# EAGLE design max32620fthr (EAGLE 7.5.0)
COMPANY: MAXIM INTEGRATED; DRAWN: GSTEIERT; REV: 2; TITLE: MAX32620FTHR

## Sheet 1 of 2
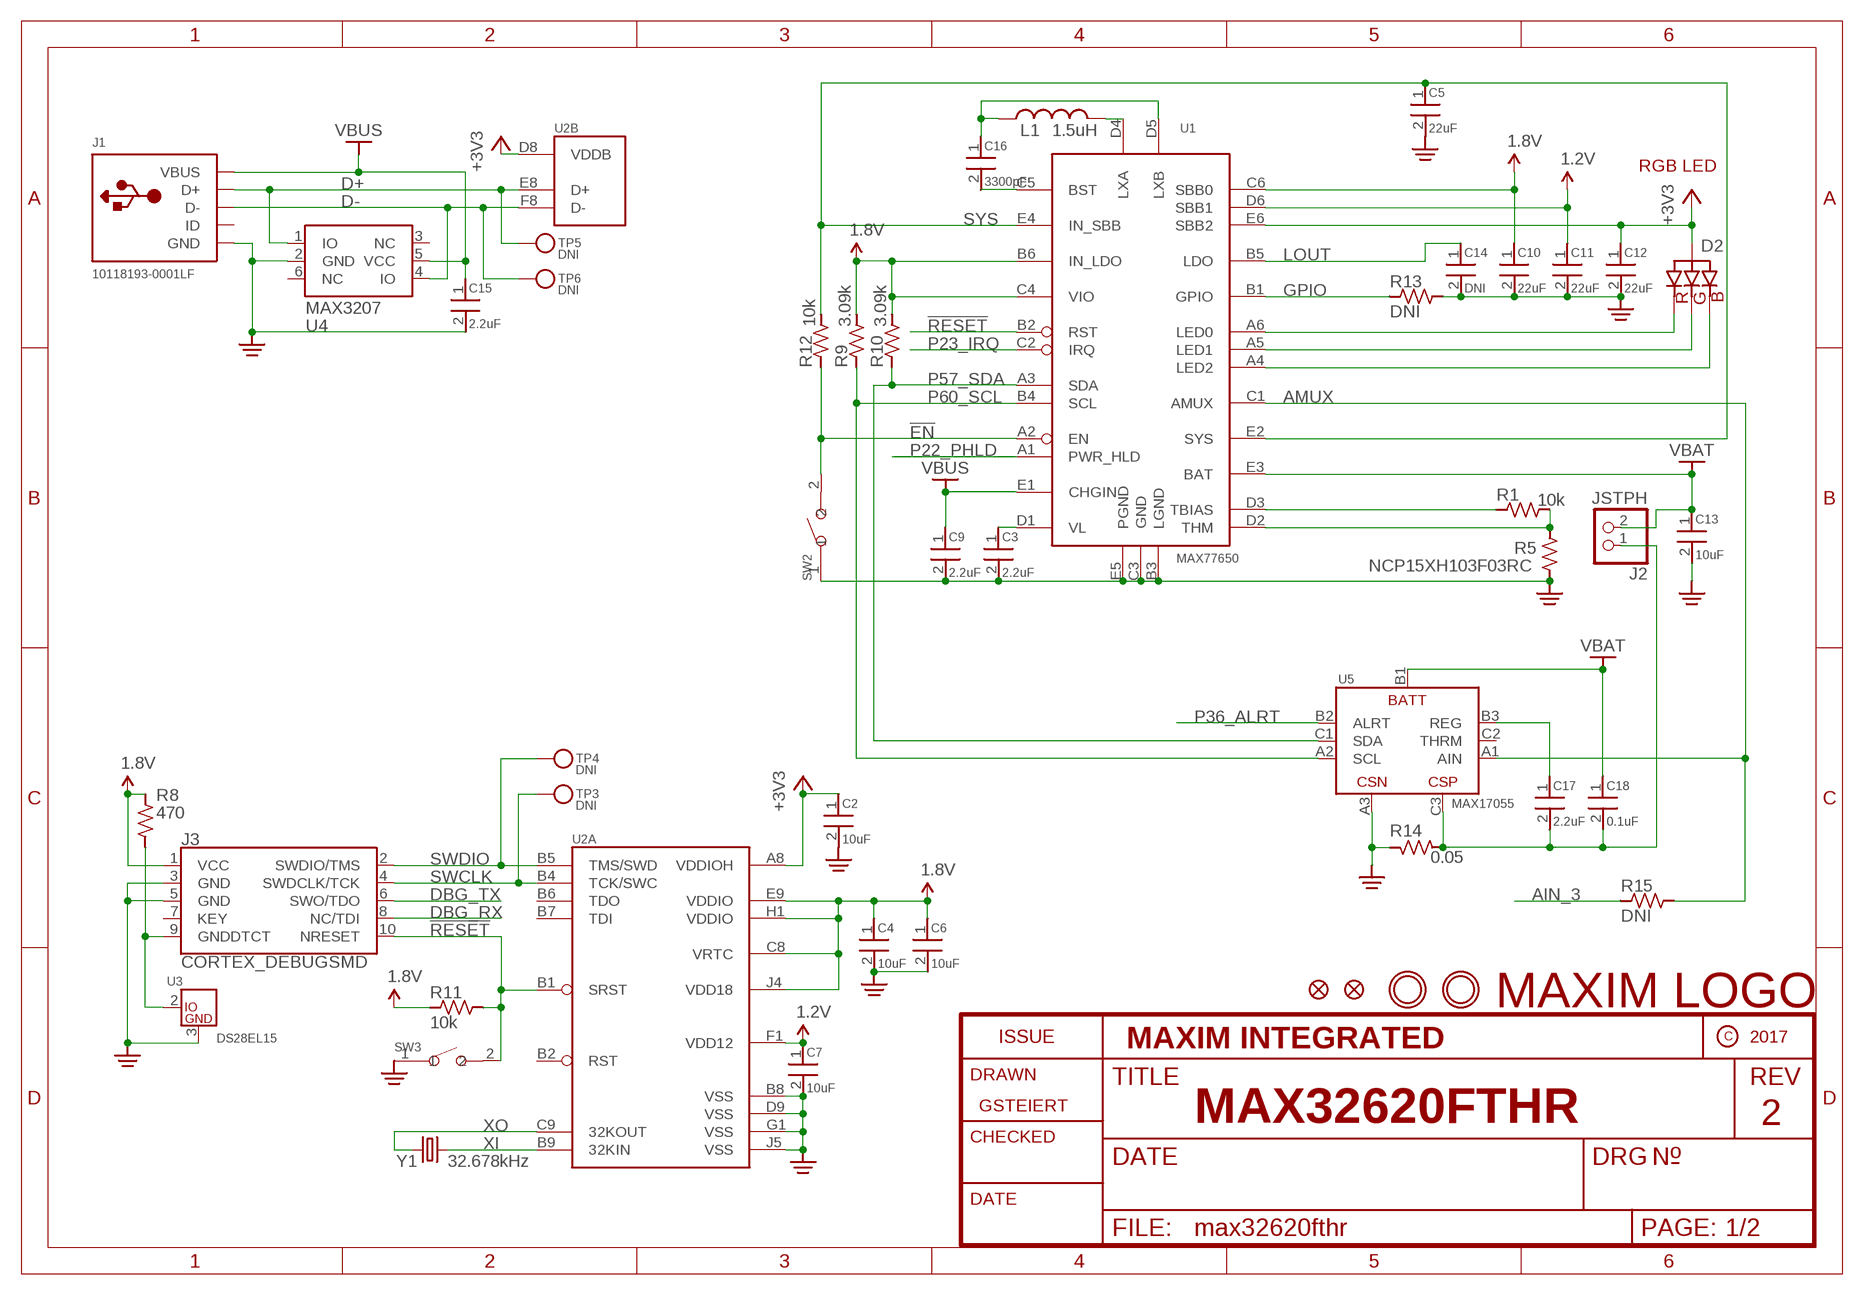
[diagram p0: schematic, sheet 1]

### Parts
C2  10uF  C0402  [0402]
C3  2.2uF  C0402  [0402]
C4  10uF  C0402  [0402]
C5  22uF  C0402  [0402]
C6  10uF  C0402  [0402]
C7  10uF  C0402  [0402]
C9  2.2uF  C0402  [0402]
C10  22uF  C0402  [0402]
C11  22uF  C0402  [0402]
C12  22uF  C0402  [0402]
C13  10uF  C0402  [0402]
C14  DNI  C0402  [0402]
C15  2.2uF  C0402  [0402]
C16  3300pF  C0402  [0402]
C17  2.2uF  C0402  [0402]
C18  0.1uF  C0402  [0402]
D2  RGBLED_CALUMIX-SML-LX0404  [LUMIX-SML-LX0404]
J1  10118193-0001LF  MICRO-USB-SMD-B-(10118193-0001LF)  [MICRO-USB5+6P-SMD-0.65-B]
J2  JSTPH  CON_JST_PH_2PIN  [JSTPH2]
J3  CORTEX_DEBUGSMD  [SAMTECH_FTSH-105-01]
L1  1.5uH  INDUCTOR2016  [IND2016]
R1  10k  R  [0402]
R5  NCP15XH103F03RC  R  [0402]
R8  470  R  [0402]
R9  3.09k  R  [0402]
R10  3.09k  R  [0402]
R11  10k  R  [0402]
R12  10k  R  [0402]
R13  DNI  R  [0402]
R14  0.05  R  [0402]
R15  DNI  R  [0402]
SW2  SMD-BUTTON(2P-3.0X2.5X1.2+0.4MM)-B3U-1000P-2P-SMD  [SW2-2.6-3.0X2.5X1.2+0.4MM]
SW3  SMD-BUTTON(2P-3.0X2.5X1.2+0.4MM)-B3U-1000P-2P-SMD  [SW2-2.6-3.0X2.5X1.2+0.4MM]
TP3  DNI  TESTPOINTROUND1MM  [TESTPOINT_ROUND_1MM]
TP4  DNI  TESTPOINTROUND1MM  [TESTPOINT_ROUND_1MM]
TP5  DNI  TESTPOINTROUND1MM  [TESTPOINT_ROUND_1MM]
TP6  DNI  TESTPOINTROUND1MM  [TESTPOINT_ROUND_1MM]
U1  MAX77650  [W302H2-1]
U2  MAX32620  [W813D3-1]
U3  DS28EL15  [T633-2]
U4  MAX3207  [SOT23-6]
U5  MAX17055  [W91N1-1]
U$3  DNI  MAXIM_LOGO  [MXM_LOGO_6MM]
U$31  DNI  MOUNTINGHOLE2.5  [MOUNTINGHOLE_2.5_PLATED]
U$32  DNI  MOUNTINGHOLE2.5  [MOUNTINGHOLE_2.5_PLATED]
U$34  DNI  FIDUCIAL""  [FIDUCIAL_1MM]
U$35  DNI  FIDUCIAL""  [FIDUCIAL_1MM]
Y1  32.678kHz  FC-12M  [FC-12M]

### Nets
1.2V: C7.1 C11.1 U1.D6(SBB1) U2.F1(A:VDD12)
1.8V: C4.1 C6.1 C10.1 J3.1(VCC) R8.2 R9.2 R10.2 R11.1 U1.B6(IN_LDO) U1.C4(VIO) U1.C6(SBB0) U2.C8(A:VRTC) U2.E9(A:VDDIO) U2.H1(A:VDDIO) U2.J4(A:VDD18) ; also sheet 2
!EN: R12.1 SW2.2 U1.A2(EN) ; also sheet 2
!RESET: J3.10(NRESET) R11.2 SW3.2 U1.B2(RST) U2.B1(A:SRST) ; also sheet 2
+3V3: C2.1 C12.1 D2.1(VCC) U1.E6(SBB2) U2.A8(A:VDDIOH) U2.D8(B:VDDB) ; also sheet 2
AIN_3: R15.1 ; also sheet 2
AMUX: R15.2 U1.C1(AMUX) U5.A1(AIN)
D+: J1.3(D+) TP5.P$1 U2.E8(B:D+) U4.1(IO)
D-: J1.2(D-) TP6.P$1 U2.F8(B:D-) U4.4(IO)
DBG_RX: J3.8(NC/TDI) ; also sheet 2
DBG_TX: J3.6(SWO/TDO) ; also sheet 2
GND: C2.2 C3.2 C4.2 C5.2 C6.2 C7.2 C9.2 C10.2 C11.2 C12.2 C13.2 C14.2 C15.2 J1.5(GND) J1.S1(GND) J1.S2(GND) J1.S3(GND) J1.S4(GND) J1.S5(GND) J1.S6(GND) J3.3(GND) J3.5(GND) R5.2 R13.2 R14.2 SW2.1 SW3.1 U1.B3(LGND) U1.C3(GND) U1.E5(PGND) U2.B8(A:VSS) U2.D9(A:VSS) U2.G1(A:VSS) U2.J5(A:VSS) U3.3(GND) U4.2(GND) U5.A3(CSN) ; also sheet 2
GPIO: R13.1 U1.B1(GPIO)
LOUT: C14.1 U1.B5(LDO)
N$1: D2.2(RED) U1.A6(LED0)
N$2: D2.4(GREEN) U1.A5(LED1)
N$3: D2.3(BLUE) U1.A4(LED2)
N$6: C3.1 U1.D1(VL)
N$8: R1.2 R5.1 U1.D2(THM)
N$9: R1.1 U1.D3(TBIAS)
N$13: J3.9(GNDDTCT) R8.1 U3.2(IO)
N$14: C17.2 C18.2 J2.1 R14.1 U5.C3(CSP)
N$15: C17.1 U5.B3(REG)
N$17: C16.2 U1.C5(BST)
N$18: C16.1 L1.1 U1.D5(LXB)
N$19: L1.2 U1.D4(LXA)
P22_PHLD: U1.A1(PWR_HLD) ; also sheet 2
P23_IRQ: U1.C2(IRQ) ; also sheet 2
P36_ALRT: U5.B2(ALRT) ; also sheet 2
P57_SDA: R10.1 U1.A3(SDA) U5.C1(SDA) ; also sheet 2
P60_SCL: R9.1 U1.B4(SCL) U5.A2(SCL) ; also sheet 2
SWCLK: J3.4(SWDCLK/TCK) TP3.P$1 U2.B4(A:TCK/SWC)
SWDIO: J3.2(SWDIO/TMS) TP4.P$1 U2.B5(A:TMS/SWD)
SYS: C5.1 R12.2 U1.E2(SYS) U1.E4(IN_SBB) ; also sheet 2
VBAT: C13.1 C18.1 J2.2 U1.E3(BAT) U5.B1(BATT) ; also sheet 2
VBUS: C9.1 C15.1 J1.1(VBUS) U1.E1(CHGIN) U4.5(VCC) ; also sheet 2
XI: U2.B9(A:32KIN) Y1.2
XO: U2.C9(A:32KOUT) Y1.1
Unconnected: J1.4(ID) J3.7(KEY) U2.B2(A:RST) U2.B6(A:TDO) U2.B7(A:TDI) U4.3(NC) U4.6(NC) U5.C2(THRM)

### Notes on the sheet
- RGB LED

## Sheet 2 of 2
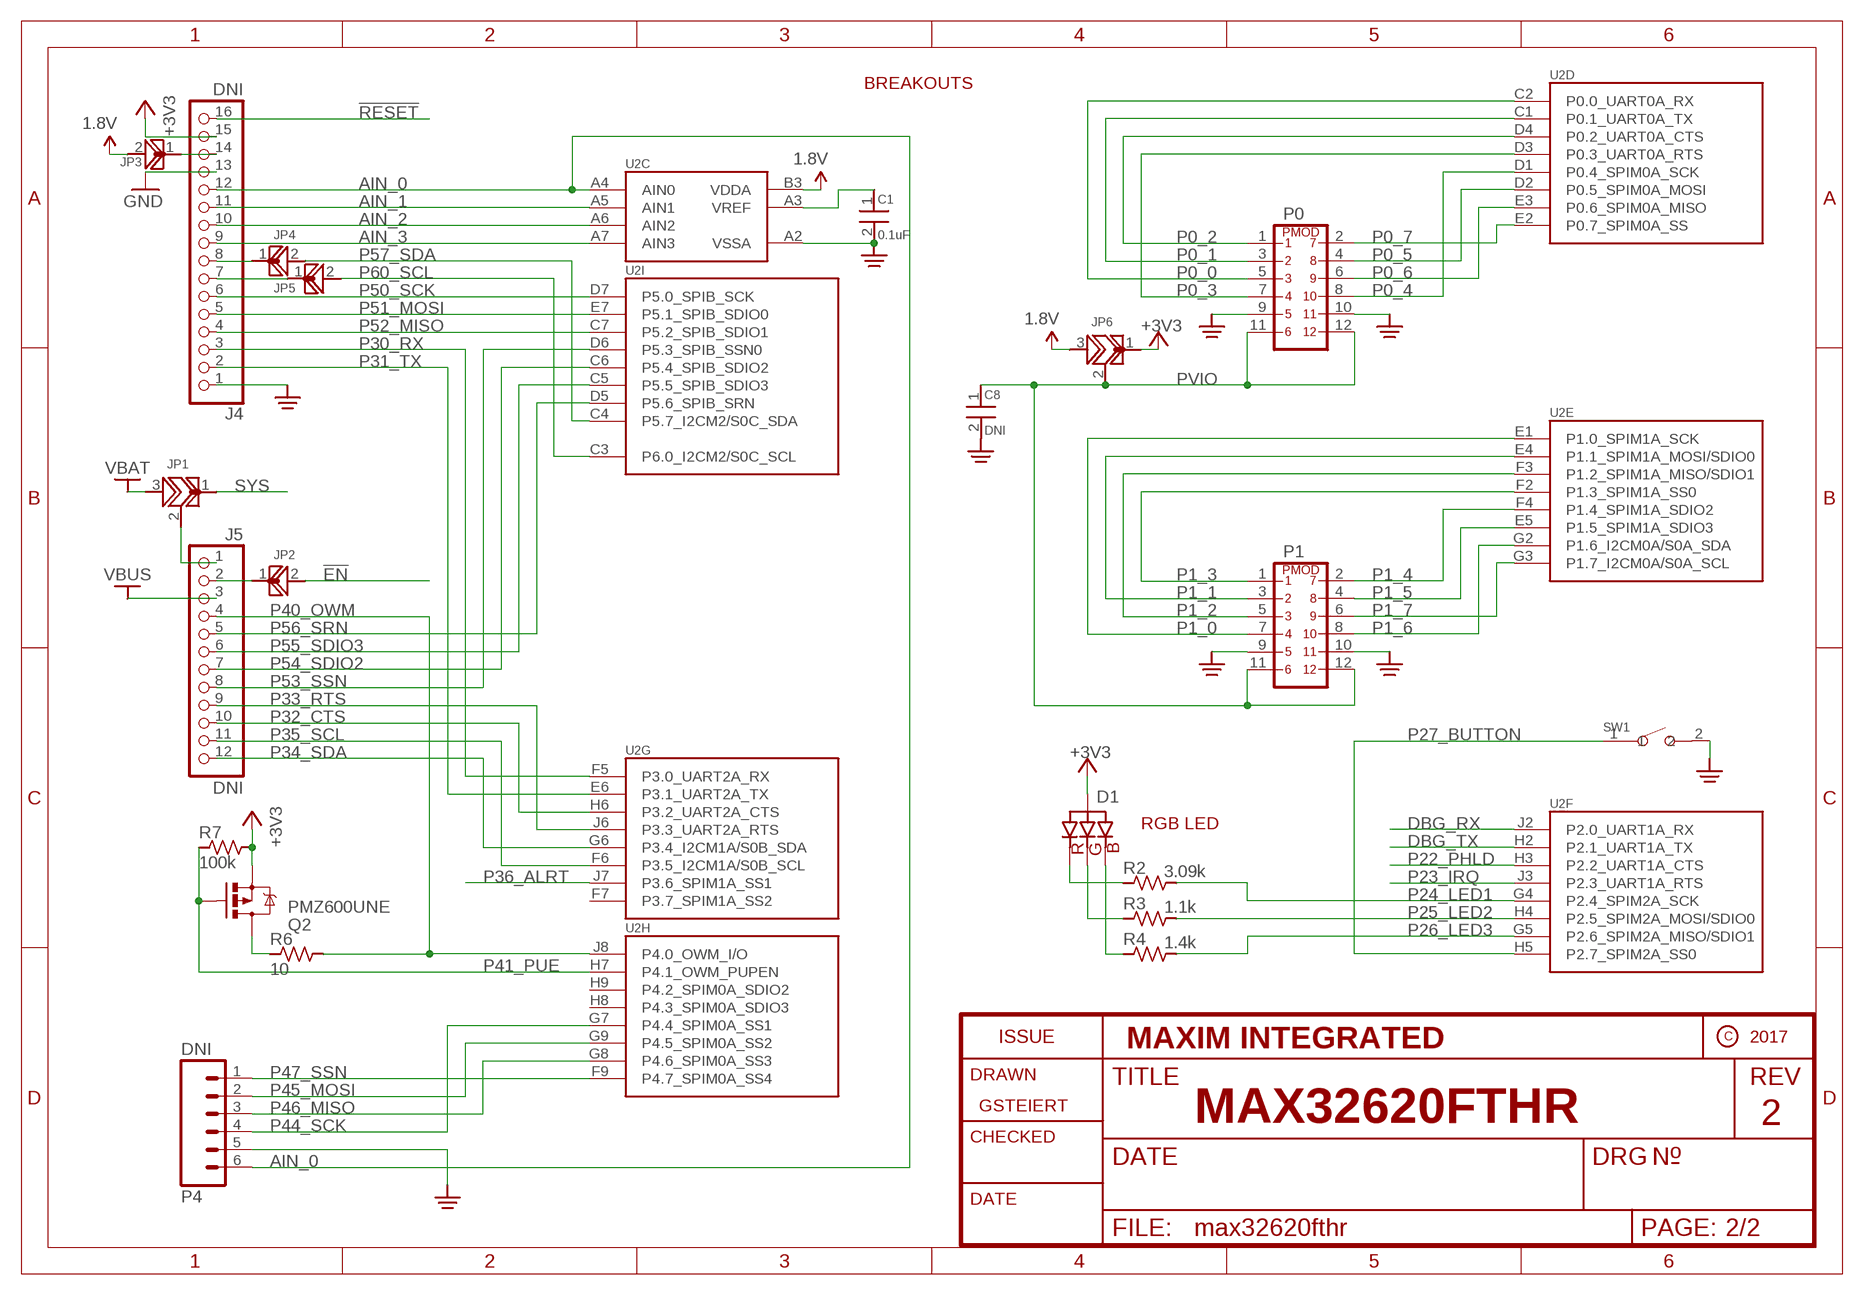
[diagram p1: schematic, sheet 2]

### Parts
C1  0.1uF  C0402  [0402]
C8  DNI  C0402  [0402]
D1  RGBLED_CALUMIX-SML-LX0404  [LUMIX-SML-LX0404]
J4  DNI  HEADER-1X16ROUND  [1X16_ROUND]
J5  DNI  HEADER-1X12  [1X12_ROUND]
JP1  DNI  SOLDER_SELECTOR  [SS0402]
JP2  DNI  SOLDER_BRIDGE  [SB0402]
JP3  DNI  SOLDER_BRIDGE  [SB0402]
JP4  DNI  SOLDER_BRIDGE  [SB0402]
JP5  DNI  SOLDER_BRIDGE  [SB0402]
JP6  DNI  SOLDER_SELECTOR  [SS0402]
P0  PMOD_DUALPASSTHROUGH  [2X6_HLE_BE]
P1  PMOD_DUALPASSTHROUGH  [2X6_HLE_BE]
P4  DNI  M061X06-SMD_EDGE_FEMALE  [1X06-SMD_EDGE]
Q2  PMZ600UNE  [SOT-883]
R2  3.09k  R  [0402]
R3  1.1k  R  [0402]
R4  1.4k  R  [0402]
R6  10  R  [0402]
R7  100k  R  [0402]
SW1  SMD-BUTTON(2P-3.0X2.5X1.2+0.4MM)-B3U-1000P-2P-SMD  [SW2-2.6-3.0X2.5X1.2+0.4MM]

### Nets
1.8V: JP3.2 JP6.3 U2.B3(C:VDDA) ; also sheet 1
!EN: JP2.2 ; also sheet 1
!RESET: J4.16 ; also sheet 1
+3V3: D1.1(VCC) J4.15 JP6.1 Q2.2(S) R7.2 ; also sheet 1
AIN_0: J4.12 P4.6 U2.A4(C:AIN0)
AIN_1: J4.11 U2.A5(C:AIN1)
AIN_2: J4.10 U2.A6(C:AIN2)
AIN_3: J4.9 U2.A7(C:AIN3) ; also sheet 1
DBG_RX: U2.J2(F:P2.0_UART1A_RX) ; also sheet 1
DBG_TX: U2.H2(F:P2.1_UART1A_TX) ; also sheet 1
GND: C1.2 C8.2 J4.1 J4.13 P0.9 P0.10 P1.9 P1.10 P4.5 SW1.2 U2.A2(C:VSSA) ; also sheet 1
N$4: J4.8 JP4.1
N$5: J4.7 JP5.1
N$7: J4.14 JP3.1
N$10: J5.2 JP2.1
N$11: J5.1 JP1.2
N$46: D1.2(RED) R2.1
N$47: D1.4(GREEN) R3.1
N$48: D1.3(BLUE) R4.1
N$50: Q2.3(D) R6.1
N$55: C1.1 U2.A3(C:VREF)
P0_0: P0.5 U2.C2(D:P0.0_UART0A_RX)
P0_1: P0.3 U2.C1(D:P0.1_UART0A_TX)
P0_2: P0.1 U2.D4(D:P0.2_UART0A_CTS)
P0_3: P0.7 U2.D3(D:P0.3_UART0A_RTS)
P0_4: P0.8 U2.D1(D:P0.4_SPIM0A_SCK)
P0_5: P0.4 U2.D2(D:P0.5_SPIM0A_MOSI)
P0_6: P0.6 U2.E3(D:P0.6_SPIM0A_MISO)
P0_7: P0.2 U2.E2(D:P0.7_SPIM0A_SS)
P1_0: P1.7 U2.E1(E:P1.0_SPIM1A_SCK)
P1_1: P1.3 U2.E4(E:P1.1_SPIM1A_MOSI/SDIO0)
P1_2: P1.5 U2.F3(E:P1.2_SPIM1A_MISO/SDIO1)
P1_3: P1.1 U2.F2(E:P1.3_SPIM1A_SS0)
P1_4: P1.2 U2.F4(E:P1.4_SPIM1A_SDIO2)
P1_5: P1.4 U2.E5(E:P1.5_SPIM1A_SDIO3)
P1_6: P1.8 U2.G2(E:P1.6_I2CM0A/S0A_SDA)
P1_7: P1.6 U2.G3(E:P1.7_I2CM0A/S0A_SCL)
P22_PHLD: U2.H3(F:P2.2_UART1A_CTS) ; also sheet 1
P23_IRQ: U2.J3(F:P2.3_UART1A_RTS) ; also sheet 1
P24_LED1: R2.2 U2.G4(F:P2.4_SPIM2A_SCK)
P25_LED2: R3.2 U2.H4(F:P2.5_SPIM2A_MOSI/SDIO0)
P26_LED3: R4.2 U2.G5(F:P2.6_SPIM2A_MISO/SDIO1)
P27_BUTTON: SW1.1 U2.H5(F:P2.7_SPIM2A_SS0)
P30_RX: J4.3 U2.F5(G:P3.0_UART2A_RX)
P31_TX: J4.2 U2.E6(G:P3.1_UART2A_TX)
P32_CTS: J5.10 U2.H6(G:P3.2_UART2A_CTS)
P33_RTS: J5.9 U2.J6(G:P3.3_UART2A_RTS)
P34_SDA: J5.12 U2.G6(G:P3.4_I2CM1A/S0B_SDA)
P35_SCL: J5.11 U2.F6(G:P3.5_I2CM1A/S0B_SCL)
P36_ALRT: U2.J7(G:P3.6_SPIM1A_SS1) ; also sheet 1
P40_OWM: J5.4 R6.2 U2.J8(H:P4.0_OWM_I/O)
P41_PUE: Q2.1(G) R7.1 U2.H7(H:P4.1_OWM_PUPEN)
P44_SCK: P4.4 U2.G7(H:P4.4_SPIM0A_SS1)
P45_MOSI: P4.2 U2.G9(H:P4.5_SPIM0A_SS2)
P46_MISO: P4.3 U2.G8(H:P4.6_SPIM0A_SS3)
P47_SSN: P4.1 U2.F9(H:P4.7_SPIM0A_SS4)
P50_SCK: J4.6 U2.D7(I:P5.0_SPIB_SCK)
P51_MOSI: J4.5 U2.E7(I:P5.1_SPIB_SDIO0)
P52_MISO: J4.4 U2.C7(I:P5.2_SPIB_SDIO1)
P53_SSN: J5.8 U2.D6(I:P5.3_SPIB_SSN0)
P54_SDIO2: J5.7 U2.C6(I:P5.4_SPIB_SDIO2)
P55_SDIO3: J5.6 U2.C5(I:P5.5_SPIB_SDIO3)
P56_SRN: J5.5 U2.D5(I:P5.6_SPIB_SRN)
P57_SDA: JP4.2 U2.C4(I:P5.7_I2CM2/S0C_SDA) ; also sheet 1
P60_SCL: JP5.2 U2.C3(I:P6.0_I2CM2/S0C_SCL) ; also sheet 1
PVIO: C8.1 JP6.2 P0.11 P0.12 P1.11 P1.12
SYS: JP1.1 ; also sheet 1
VBAT: JP1.3 ; also sheet 1
VBUS: J5.3 ; also sheet 1
Unconnected: U2.F7(G:P3.7_SPIM1A_SS2) U2.H8(H:P4.3_SPIM0A_SDIO3) U2.H9(H:P4.2_SPIM0A_SDIO2)

### Notes on the sheet
- BREAKOUTS
- RGB LED

## Library data of the parts
C1-C18 = maxlib:C: C Capacitor
D1 D2 = maxlib:RGBLED_CA: RGB LED, common-anode Lumix SML-LX0404 1mm x 1mm 5MM Staggered pins 5mm Piranha package http://www.ladyada.net/library/pcb/eaglelibrary.html
J1 = maxlib:MICRO-USB-SMD-B-(10118193-0001LF): 320010003; MPN: 10118193-0001LF
J2 = microbuilder:CON_JST_PH_2PIN: JST 2-Pin Right-Angle Connector PH-Series - 4UConnector: 17311 SH-Series - 4UConnector: 07278
J3 = maxlib:CORTEX_DEBUG: Cortex Debug Connector Datasheet <http://infocenter.arm.com/help/topic/com.arm.doc.faqs/attached/13634/cortex_debug_connectors.pdf>
J4 = microbuilder:HEADER-1X16: PIN HEADER
J5 = microbuilder:HEADER-1X12
JP1 JP6 = maxlib:SOLDER_SELECTOR: Solder Selector 0402
JP2-JP5 = maxlib:SOLDER_BRIDGE: Solder Bridge 0402
L1 = maxlib:INDUCTOR: Inductor Inductors
P0 P1 = maxlib:PMOD_DUAL: Dual Row PMOD Header
P4 = SparkFun-Connectors:M06: Header 6 Standard 6-pin 0.1" header. Use with straight break away headers (SKU : PRT-00116), right angle break away headers (PRT-00553), swiss pins (PRT-00743), machine pins (PRT-00117), and female headers (PRT-00115). Molex polarized connector foot print use with SKU : PRT-08094 with associated crimp pins and housings. NOTES ON THE VARIANTS LOCK and LOCK_LONGPADS... This footprint was designed to help hold the alignment of a through-hole component (i.e. 6-pin header) while soldering it into place. You may notice that each hole has been shifted either up or down by 0.005 of an inch from it's more standard position (which is a perfectly straight line). This slight alteration caused the pins (the squares in the middle) to touch the edges of the holes. Because they are alternating, it causes a "brace" to hold the component in place. 0.005 has proven to be the perfect amount of "off-center" position when using our standard breakaway headers. Although looks a little odd when you look at the bare footprint, once you have a header in there, the alteration is very hard to notice. Also,if you push a header all the way into place, it is covered up entirely on the bottom side. This idea of altering the position of holes to aid alignment will be further integrated into the Sparkfun Library for other footprints. It can help hold any component with 3 or more connection pins.
Q2 = maxlib:PMZ600UNE
R1-R15 = maxlib:R: Resistor
SW1-SW3 = maxlib:SMD-BUTTON(2P-3.0X2.5X1.2+0.4MM): 311020047
TP3-TP6 = maxlib:TESTPOINT: Test Point Various test points for characterisation and PCB testing TESTPOINT_SMT - Compact Surface Mount Test Point [Digikey: 5016KTR-ND]
U1 = maxlib:MAX77650: MAX77650 Ultra-Low Power SIMO PMIC Battery Charger with Smart Power Selector 3 output Single Inductor Multiple Output Buck-Boost 150mA LDO 3 channel LED current sink Voltage Monitor Multiplexer
U2 = maxlib:MAX32620: MAX32620 Ultra-Low Power, High-Performance Cortex-M4F Microcontroller for Wearables
U3 = maxlib:DS28EL15: DS28EL15 1-Wire SHA-256 and 512-Bit EEPROM
U4 = maxlib:MAX3207: MAX3207 DUAL ESD with TVS
U5 = maxlib:MAX17055: MAX17055 ModelGauge m5 EZ, 1-Cell Fuel Gauge
U$3 = maxlib:MAXIM_LOGO: Maxim Logo
U$31 U$32 = microbuilder:MOUNTINGHOLE: Mounting Hole For #2 screws (0.086"/2.18mm width, 0.094"/2.4mm hole) use 2.5mm; BOM: EXCLUDE
U$34 U$35 = microbuilder:FIDUCIAL: Fiducial Alignment Points Various fiducial points for machine vision alignment.; BOM: EXCLUDE
Y1 = maxlib:FC-12M: kHz RANGE CRYSTAL UNIT LOW PROFILE SMD Source: Epson Toyocom FC-12M.pdf

## Board
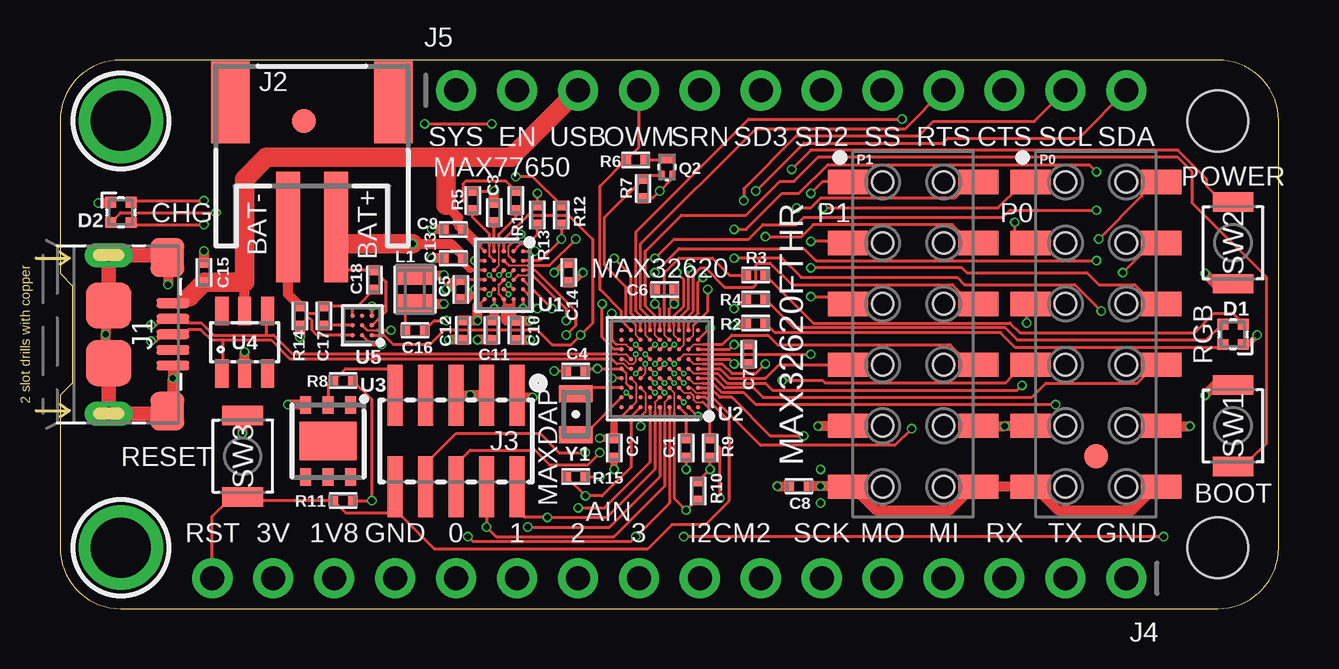
[diagram p2: board, top side]
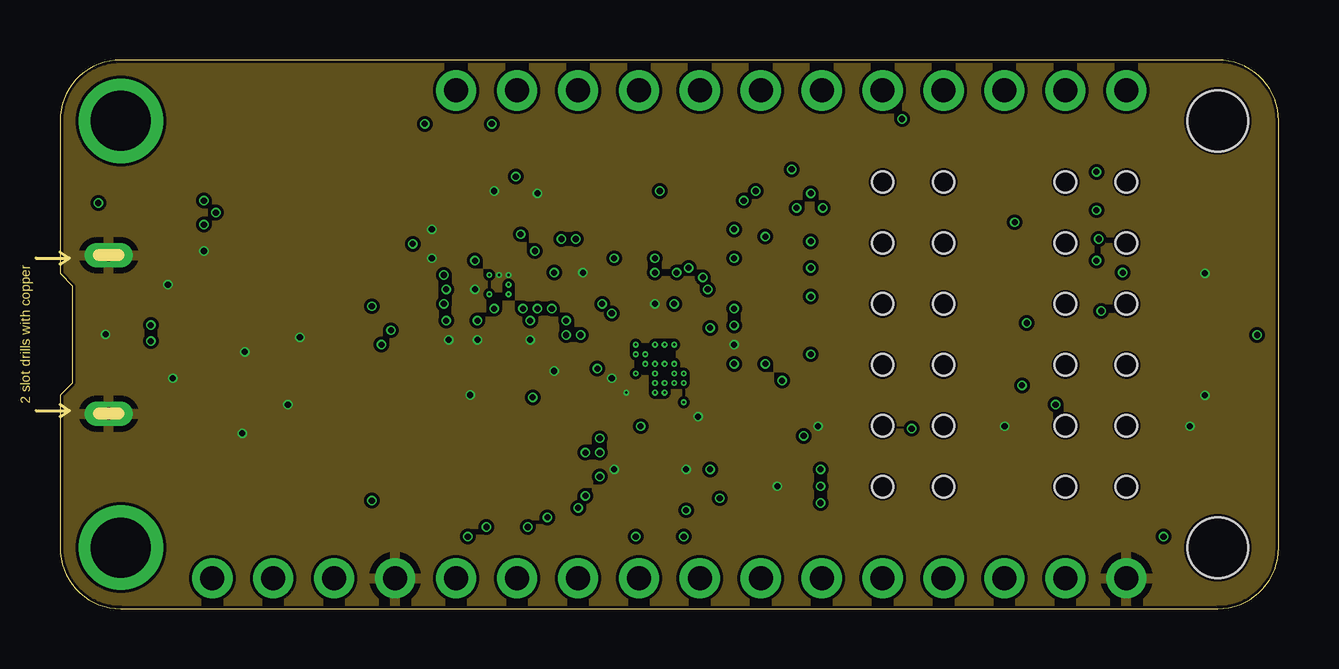
[diagram p3: board, inner layer Route2]
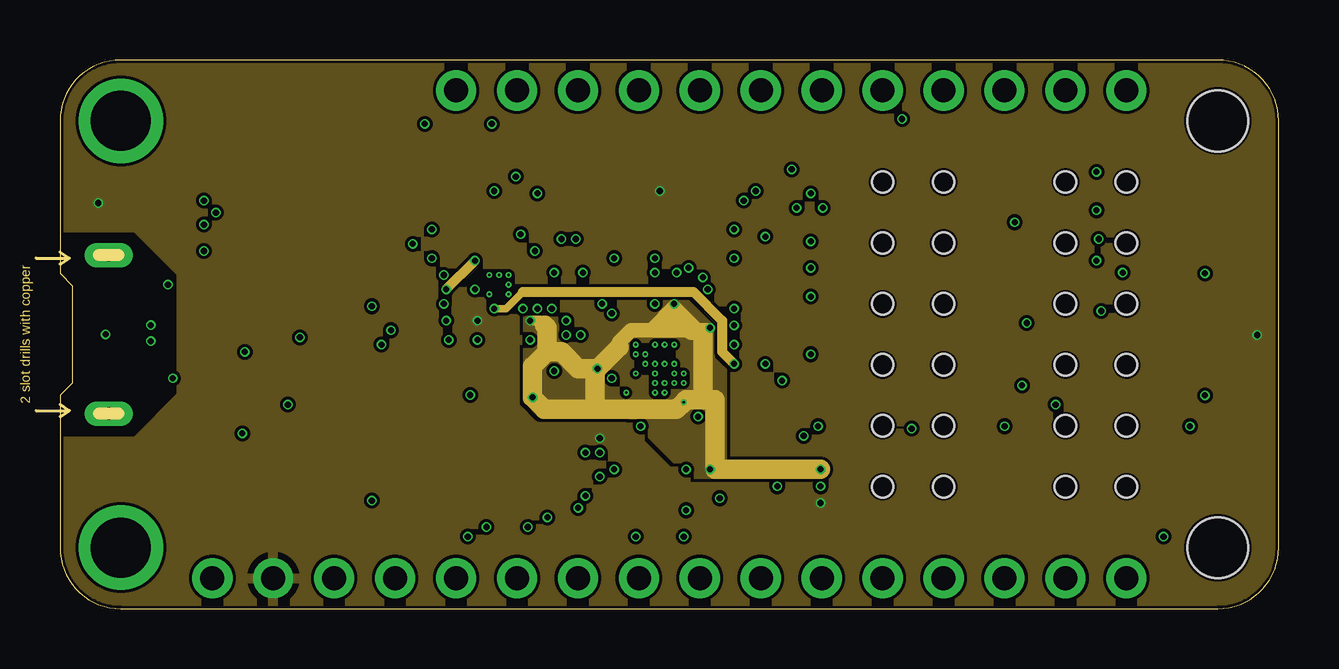
[diagram p4: board, inner layer Route15]
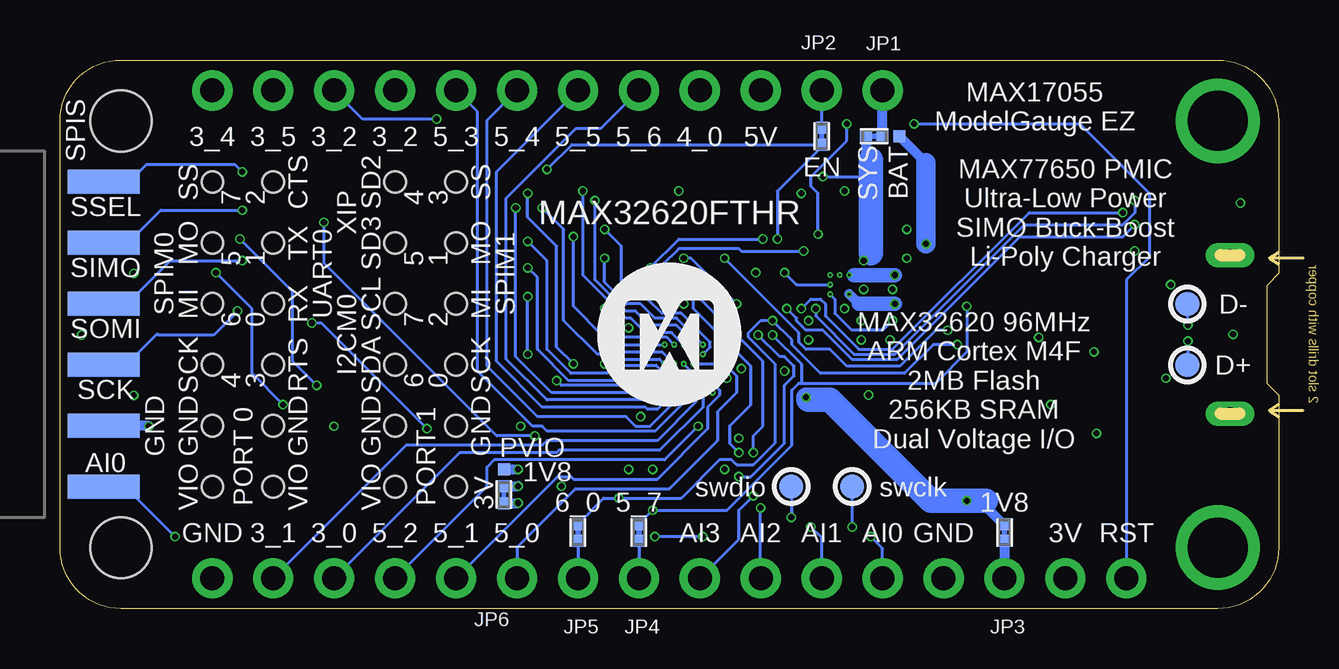
[diagram p5: board, bottom side, seen from below]

Size 50.8 x 22.86 mm. Coordinates in mm from the lower left corner, seen from the top.
Outline: 2.54,0 48.26,0 arc90 50.8,2.54 50.8,20.32 arc90 48.26,22.86 2.54,22.86 arc90 0,20.32 0,13.97 0.51,13.46 0.51,9.4 0,8.89 0,2.54 arc90 2.54,0
Copper layers (1+2*15+16): Top 0.035mm / dielectric 0.17mm / Route2 0.018mm / dielectric 1.19mm / Route15 0.018mm / dielectric 0.17mm / Bottom 0.035mm
Design rules "adafruit *": minimum track width 0.075mm, minimum drill 0.1mm, track to track 0.07mm, track to pad 0.07mm, pad to pad 5mil, via to via 5mil, smd to smd 3mil, copper to edge 5mil, drill to drill 8mil, minimum pad ring 10mil, minimum via ring 0.07mm, stop-mask expansion 0mil, vias tented up to drill 20mil, thermal gap 10mil
Holes 2.54 mm at 48.26,20.32 48.26,2.54

### Footprints (pad centres in the part's own frame; a part is rotated, then mirrored left to right if it is on the bottom)
0402 = smd 0.5 x 0.4: 1 0,0.4; 2 0,-0.4
LUMIX-SML-LX0404 = smd 0.45 x 0.45: 1 -0.425,0.425; 2 0.425,0.425; 3 0.425,-0.425; 4 -0.425,-0.425
MICRO-USB5+6P-SMD-0.65-B = smd 0.4 x 1.35: 1 -1.3,2.675; 2 -0.65,2.675; 3 0,2.675; 4 0.65,2.675; 5 1.3,2.675 | smd 1.6 x 1.4: S1 -3.2,2.45; S6 3.2,2.45 | drill 0.508 pad 1.016 long: S2 -3.3,0; S5 3.3,0 | smd 1.9 x 1.9: S3 -1.2,0; S4 1.2,0
JSTPH2 = smd 1 x 4.6: 1 -1,-3.7; 2 1,-3.7 | smd 1.6 x 3.4: NC1 -3.4,1.5; NC2 3.4,1.5
SAMTECH_FTSH-105-01 = smd 0.635 x 2.54: 1 -2.54,-1.905; 2 -2.54,1.905; 3 -1.27,-1.905; 4 -1.27,1.905; 5 0,-1.905; 6 0,1.905; 7 1.27,-1.905; 8 1.27,1.905; 9 2.54,-1.905; 10 2.54,1.905
1X16_ROUND = drill 1 pad 1.676: 1 -19.05,0; 2 -16.51,0; 3 -13.97,0; 4 -11.43,0; 5 -8.89,0; 6 -6.35,0; 7 -3.81,0; 8 -1.27,0; 9 1.27,0; 10 3.81,0; 11 6.35,0; 12 8.89,0; 13 11.43,0; 14 13.97,0; 15 16.51,0; 16 19.05,0
1X12_ROUND = drill 1 pad 1.676: 1 -13.97,0; 2 -11.43,0; 3 -8.89,0; 4 -6.35,0; 5 -3.81,0; 6 -1.27,0; 7 1.27,0; 8 3.81,0; 9 6.35,0; 10 8.89,0; 11 11.43,0; 12 13.97,0
SS0402 = smd 0.5 x 0.5: 1 0,0.7; 2 0,0; 3 0,-0.7
SB0402 = smd 0.5 x 0.5: 1 0,0.35; 2 0,-0.35
IND2016 = smd 1.6 x 0.8: 1 0,0.6; 2 0,-0.6
2X6_HLE_BE = smd 1.016 x 1.676: 1 -6.35,-2.718; 2 -6.35,2.718; 3 -3.81,-2.718; 4 -3.81,2.718; 5 -1.27,-2.718; 6 -1.27,2.718; 7 1.27,-2.718; 8 1.27,2.718; 9 3.81,-2.718; 10 3.81,2.718; 11 6.35,-2.718; 12 6.35,2.718 | hole 0.889: -6.35,1.27; -3.81,1.27; -1.27,1.27; 1.27,1.27; 3.81,1.27; 6.35,1.27; 6.35,-1.27; 3.81,-1.27; 1.27,-1.27; -1.27,-1.27; -3.81,-1.27; -6.35,-1.27
1X06-SMD_EDGE = smd 1 x 3: 1 0,-0.08; 2 2.54,-0.08; 3 5.08,-0.08; 4 7.62,-0.08; 5 10.16,-0.08; 6 12.7,-0.08
SOT-883 = smd 0.25 x 0.4: 1 -0.225,-0.35; 2 0.225,-0.35 | smd 0.7 x 0.4: 3 0,0.35
SW2-2.6-3.0X2.5X1.2+0.4MM = smd 0.8 x 1.7: 1 -1.7,0; 2 1.7,0
TESTPOINT_ROUND_1MM = smd 1 x 1: P$1 0,0
W302H2-1 = smd 0.18 x 0.18: A1 -1,0.8; A2 -0.6,0.8; A3 -0.2,0.8; A4 0.2,0.8; A5 0.6,0.8; A6 1,0.8; B1 -1,0.4; B2 -0.6,0.4; B3 -0.2,0.4; B4 0.2,0.4; B5 0.6,0.4; B6 1,0.4; C1 -1,0; C2 -0.6,0; C3 -0.2,0; C4 0.2,0; C5 0.6,0; C6 1,0; D1 -1,-0.4; D2 -0.6,-0.4; D3 -0.2,-0.4; D4 0.2,-0.4; D5 0.6,-0.4; D6 1,-0.4; E1 -1,-0.8; E2 -0.6,-0.8; E3 -0.2,-0.8; E4 0.2,-0.8; E5 0.6,-0.8; E6 1,-0.8
W813D3-1 = smd 0.18 x 0.18: A1 -1.6,1.6; A2 -1.2,1.6; A3 -0.8,1.6; A4 -0.4,1.6; A5 0,1.6; A6 0.4,1.6; A7 0.8,1.6; A8 1.2,1.6; A9 1.6,1.6; B1 -1.6,1.2; B2 -1.2,1.2; B3 -0.8,1.2; B4 -0.4,1.2; B5 0,1.2; B6 0.4,1.2; B7 0.8,1.2; B8 1.2,1.2; B9 1.6,1.2; C1 -1.6,0.8; C2 -1.2,0.8; C3 -0.8,0.8; C4 -0.4,0.8; C5 0,0.8; C6 0.4,0.8; C7 0.8,0.8; C8 1.2,0.8; C9 1.6,0.8; D1 -1.6,0.4; D2 -1.2,0.4; D3 -0.8,0.4; D4 -0.4,0.4; D5 0,0.4; D6 0.4,0.4; D7 0.8,0.4; D8 1.2,0.4; D9 1.6,0.4; E1 -1.6,0; E2 -1.2,0; E3 -0.8,0; E4 -0.4,0; E5 0,0; E6 0.4,0; E7 0.8,0; E8 1.2,0; E9 1.6,0; F1 -1.6,-0.4; F2 -1.2,-0.4; F3 -0.8,-0.4; F4 -0.4,-0.4; F5 0,-0.4; F6 0.4,-0.4; F7 0.8,-0.4; F8 1.2,-0.4; F9 1.6,-0.4; G1 -1.6,-0.8; G2 -1.2,-0.8; G3 -0.8,-0.8; G4 -0.4,-0.8; G5 0,-0.8; G6 0.4,-0.8; G7 0.8,-0.8; G8 1.2,-0.8; G9 1.6,-0.8; H1 -1.6,-1.2; H2 -1.2,-1.2; H3 -0.8,-1.2; H4 -0.4,-1.2; H5 0,-1.2; H6 0.4,-1.2; H7 0.8,-1.2; H8 1.2,-1.2; H9 1.6,-1.2; J1 -1.6,-1.6; J2 -1.2,-1.6; J3 -0.8,-1.6; J4 -0.4,-1.6; J5 0,-1.6; J6 0.4,-1.6; J7 0.8,-1.6; J8 1.2,-1.6; J9 1.6,-1.6
T633-2 = smd 0.71 x 0.46: 1 -1.5,0.94; 2 -1.5,0; 3 -1.5,-0.94; 4 1.5,-0.94; 5 1.5,0; 6 1.5,0.94 | smd 1.6 x 2.39: 9 0,0
SOT23-6 = smd 0.55 x 1.2: 1 -0.95,-1.3; 2 0,-1.3; 3 0.95,-1.3; 4 0.95,1.3; 5 0,1.3; 6 -0.95,1.3
W91N1-1 = smd 0.18 x 0.18: A1 -0.4,0.4; A2 0,0.4; A3 0.4,0.4; B1 -0.4,0; B2 0,0; B3 0.4,0; C1 -0.4,-0.4; C2 0,-0.4; C3 0.4,-0.4
MOUNTINGHOLE_2.5_PLATED = drill 2.5 pad 3.2: P$1 0,0
FIDUCIAL_1MM = smd 1 x 1: 1 0,0
FC-12M = smd 0.7 x 1.4: 1 -0.85,0; 2 0.85,0

### Placement (x,y rotation side)
C1  26.1,6.7 0 top
C2  23.1,6.7 0 top
C3  18.1,16.5 180 top
C4  21.5,9.9 270 top
C5  16.7,13.3 0 top
C6  25.2,13.3 270 top
C7  28.7,10.6 180 top
C8  30.8,5.1 270 top
C9  16.4,15.8 270 top
C10  19,11.6 0 top
C11  18,11.6 0 top
C12  16.8,11.6 0 top
C13  16.4,14.6 270 top
C14  21.2,14 0 top
C15  6,14 180 top
C16  14.8,11.6 90 top
C17  11,12.2 180 top
C18  13.1,13.7 0 top
D1  48.9,11.43 180 top
D2  2.54,16.51 0 top
DRILEGEND  [DRILEGEND]  56.57,3.1 0 top  (outside the outline)
J1  2.03,11.43 270 top
J2  10.5,19.6 0 top
J3  16.51,6.99 180 top
J4  25.4,1.27 180 top
J5  30.48,21.59 0 top
JP1  16.51,19.68 90 bottom
JP2  19.05,19.68 0 bottom
JP3  11.43,3.17 180 bottom
JP4  26.67,3.17 180 bottom
JP5  29.21,3.17 180 bottom
JP6  32.3,5.1 180 bottom
L1  14.8,13.3 180 top
P0  43.18,11.43 270 top
P1  35.56,11.43 270 top
P4  48.9,17.78 270 bottom
Q2  25.3,18.4 0 top
R1  19,17 180 top
R2  29,11.9 270 top
R3  29,13.9 270 top
R4  29,12.9 270 top
R5  17.2,17 180 top
R6  24,18.7 270 top
R7  24.3,17.5 0 top
R8  11.8,9.5 90 top
R9  27.1,6.7 0 top
R10  26.6,4.9 180 top
R11  11.8,4.5 270 top
R12  20.9,16.4 180 top
R13  19.9,16.4 180 top
R14  10,12.2 0 top
R15  21.5,5.5 90 top
SW1  48.9,7.62 90 top
SW2  48.9,15.24 90 top
SW3  7.62,6.35 270 top
TP3  17.78,5.08 0 bottom
TP4  20.32,5.08 0 bottom
TP5  3.81,10.16 0 bottom
TP6  3.81,12.7 0 bottom
U1  18.5,13.9 270 top
U2  25,10 180 top
U3  11.18,6.99 270 top
U4  7.7,11.1 0 top
U5  12.6,11.8 180 top
U$3  25.4,11.43 0 bottom
U$31  2.54,20.32 270 top
U$32  2.54,2.54 270 top
U$34  10.16,20.32 270 top
U$35  43.18,6.35 270 top
Y1  21.5,8.1 270 top

### Tracks (layer width: path | path; a pad name or v marks a point on that pad's centre or on a via)
1.2V  (via drill 0.25 pad 0.01)
  Top 0.127: U2.F1 27.9,10.4 v28.1,10.2 C7.1 | U1.D6 v18.1,12.5
  Top 0.406: v18.1,12.5 18.1,12 C11.1
  Route15 0.305: v18.1,12.5 18.6,12.5 19.3,13.2
  Route15 0.406: v28.1,10.2 27.6,10.7 27.6,12 26.4,13.2 19.3,13.2
1.8V  (via drill 0.1 pad 0.01, 0.25, 0.25 pad 0.01, 0.25 pad 0.13)
  Top 0.075: 23.6,9.8 23.6,9.4 | 18.3,13.1 18.3,13.5
  Top 0.127: 23.6,9.4 U2.C8 | U2.B3 v26,8.6 | U2.H1 v27.1,11.7 | U2.J4 25.4,12.5 v25.6,12.7 | 18.3,13.5 U1.C4 | 18.3,13.1 U1.C6 18.5,12.6 18.6,12.5 | C4.1 21.9,10 v22.4,10 U2.E9 23.6,9.8 | U1.B6 18.9,12.6 18.8,12.5 | R8.2 13,8.7 v13,4.5 R11.1 | R9.2 v27.1,5.8 R10.2
  Top 0.406: J3.1 19.14,8.8 v19.7,8.8 | C6.1 v25.6,12.7 | 18.8,12 18.6,12 18.6,12.5 | 18.8,12.5 18.8,12 | 18.8,12 C10.1 v19.6,12
  Route15 0.406: v22.4,10 22.3,9.9 | v19.6,12 20,12 20.2,11.8 | 24.5,11.6 v25.6,12.7 26.6,11.7 v27.1,11.7 26.9,11.5 | 27.3,5.8 v27.1,5.8
  Route15 0.61: 23.3,10.9 23.3,11.1 23.8,11.6 24.5,11.6 25,11.6 | 25,11.6 26.2,11.6 | 26.2,11.6 26.3,11.5 26.8,11.5 26.9,11.5 | 25,11.6 25.6,12.2 26.2,11.6
  Route15 0.813: 22.3,8.3 25.7,8.3 v26,8.6 26.1,8.7 26.8,8.7 | 22.3,8.3 20.2,8.3 v19.7,8.8 19.7,10.1 20.3,10.7 | 22.3,9.9 22.3,8.3 | 26.8,8.7 27.3,8.7 27.3,5.8 v31.7,5.8 | 26.8,11.5 26.8,8.7 | 20.3,10.7 20.3,11.7 20.2,11.8 | 20.3,10.7 20.9,10.7 21.6,10 v22.4,10 23.3,10.9
  Bottom 0.406: JP6.3 v31.7,5.8 | JP3.2 11.46,3.5 12.2,4.25 R11.1
  Bottom 0.813: v19.7,8.8 19.6,8.7
  Bottom 1.016: 19.6,8.7 18.7,8.7 14.5,4.5 v13,4.5 R11.1
  pour Route15 (isolate 0.127, rank 2): 19.5,8.7 19.5,12.4 19.8,12.7 26.1,12.7 27.1,11.7 27.1,10.4 27.6,9.9 27.6,5.9 27.3,5.6 26.3,5.6 23.8,8.1 20.1,8.1
!EN  (via drill 0.25)
  Top 0.127: R12.1 v20.9,15.4 20,14.5 U1.A2 | SW2.2 48.46,16.94 47.8,17.6 47.8,17.9 46.6,19.1 31.3,19.1 v30.5,18.3
  Bottom 0.127: JP2.2 29.46,19.34 v30.5,18.3 | JP2.2 19.07,19.34 | JP2.2 19.05,19.25 20.9,17.4 v20.9,15.4
!RESET  (via drill 0.25)
  Top 0.075: 18.7,14.7 18.7,15.1
  Top 0.127: 13.8,4.4 13.97,4.57 J3.10 13.97,6.07 14,6.1 14,4.1 14.1,4 | J4.16 6.35,3.85 7,4.5 7.47,4.5 SW3.2 | SW3.2 8.05,4.65 | v15.2,20.2 v18,20.2 | U1.B2 18.7,14.7 | 18.7,15.1 v19.2,15.6 | 14.1,4 15.6,2.5 24.5,2.5 25.5,3.5 26.9,3.5 27.9,4.5 27.9,7.8 26.9,8.8 U2.B1 | SW3.2 7.77,4.5 R11.2 11.9,4 14.1,4
  Bottom 0.127: v19.2,15.6 19.2,17.3 19.5,17.6 19.5,18 18,19.5 v18,20.2 | J4.16 6.35,13.7 5.4,14.65 5.4,17.3 8.3,20.2 v15.2,20.2
+3V3  (via drill 0.25, 0.25 pad 0.01)
  Top 0.075: U2.D8 24,9.4 24,8.6 U2.A8
  Top 0.127: U2.A8 23.1,7.7 | 17.4,12.6 U1.E6 | Q2.2 25.52,17.93 v25,17.4 24.7,17.1 R7.2
  Top 0.254: D1.1 49.51,11.01 v49.9,11.4
  Top 0.305: v22.5,7.1 C2.1 23.1,7.7
  Top 0.406: 17.4,12.6 v17.4,12 C12.1 | D2.1 2.08,16.9 v1.6,16.9
  Bottom 0.406: JP6.1 v31.7,4.4
  pour Route15 (isolate 0.127, rank 4): 50.8,0 0,0 0,6.99 3.17,6.99 5.08,8.89 5.08,13.97 3.17,15.88 0,15.88 0,22.86 50.8,22.86
AIN_0  (via drill 0.25)
  Top 0.127: U2.A4 25.4,4.4 v24,3 23.8,2.8 17.2,2.8 v17,3 | v46,3 v26,3
  Bottom 0.127: v46,3 48.08,5.08 P4.6 | J4.12 16.51,2.51 v17,3 | v24,3 v26,3
AIN_1  (via drill 0.25 pad 0.01)
  Top 0.127: U2.A5 25,5.5 22.9,3.4 v19.5,3.4
  Bottom 0.127: J4.11 19.05,2.95 v19.5,3.4
AIN_2  (via drill 0.25)
  Top 0.127: U2.A6 24.6,6.1 22.7,4.2 v21.6,4.2
  Bottom 0.127: J4.10 v21.6,4.2
AIN_3  (via drill 0.25)
  Top 0.127: U2.A7 23.8,8 23.8,5.9 22.6,4.7 v21.9,4.7 R15.1
  Bottom 0.127: v21.9,4.7 22.5,4.1 22.5,2.9 J4.9
AMUX  (via drill 0.25)
  Top 0.127: U1.C1 18.5,15.4 19.5,16.4 21.2,16.4 22.2,15.4 22.2,11.9 v21.7,11.4 21.3,11 20.5,11 19.9,11.6 16,11.6 15.4,11 13.9,11 13.5,11.4 U5.A1 | R15.2 v22.5,5.5
  Bottom 0.127: v22.5,5.5 22,5.5 20.6,6.9 20.6,9.3 20.2,9.7 20.2,10.1 20.6,10.5 20.8,10.5 v21.7,11.4
D+  (via drill 0.25)
  Top 0.075: U2.E8 23.69,10 23.49,10.2 23.2,10.2
  Top 0.127: 23.2,10.2 23,10.4 9.6,10.4 8.8,11.2 6.8,11.2 | 6.8,11.2 6.3,11.2 5.87,11.63 5.33,11.63 5.2,11.5 4.78,11.5 J1.3 4.3,11.43 4.02,11.15 v3.78,11.15 | U4.1 6.8,9.85 6.8,11.2
  Bottom 0.127: v3.78,11.15 3.78,10.19 TP5.P$1
D-  (via drill 0.25)
  Top 0.075: U2.F8 23.6,10.6
  Top 0.076: 23.2,10.6 23.6,10.6
  Top 0.127: 23.2,10.6 9.7,10.6 8.9,11.4 8.6,11.4 | 8.6,11.4 6.4,11.4 5.9,11.9 5.3,11.9 5.2,12 4.79,12 J1.2 | U4.4 8.7,12.35 8.6,12.25 8.6,11.4 | 4.73,12.1 J1.2 | v3.78,11.81 4.01,11.81 4.2,12 4.63,12 J1.2
  Bottom 0.127: v3.78,11.81 3.78,12.67 TP6.P$1
DBG_RX  (via drill 0.25)
  Top 0.127: U2.J2 26.2,11.9 26.6,12.3 26.6,13.6 v26.8,13.8 | J3.8 15.28,5.12 15.3,5.12 15.3,6.1 16.5,7.3 20,7.3 20.8,6.5 v21.9,6.5
  Bottom 0.127: v26.8,13.8 26.6,13.6 24.8,13.6 21.5,10.3 21.5,7.6 21.9,7.2 v21.9,6.5
DBG_TX  (via drill 0.25)
  Top 0.076: U2.H2 26.4,11.4 26.4,11.8
  Top 0.127: 26.4,11.8 27,12.4 v27,13.3 | J3.6 16.5,6 17.1,6.6 19.8,6.6 20.4,6 22,6 v22.5,6.5
  Bottom 0.127: v22.5,6.5 22.9,6.9 22.9,7.6 22,8.5 22,10.1 24.4,12.5 24.4,12.8 24.7,13.1 26.8,13.1 v27,13.3
GND  (via drill 0.1 pad 0.01, 0.25, 0.25 pad 0.01, 0.25 pad 0.13)
  Top 0.127: U2.D9 v23,9.6 | C4.2 v20.6,9.9 | C1.2 v26.1,5.8 | U2.B8 v23.6,9 | U1.C3 v18.3,13.9 | U1.B3 v18.7,13.9 | U2.A2 v26.6,8 | U2.G1 27.9,10.8 v28.1,11 C7.2 | U3.3 10.2,8.52 | U2.J5 25,12.5 v24.8,12.7 C6.2 | U1.E5 v17.3,13.3 | C5.2 16.9,12.9 | R5.2 v18.1,17.4 | U5.A3 10.7,11.4 10.5,11.6 10.5,12 10.4,12.1 10.3,12.1 R14.2 | R13.2 v19.9,17.3 | C14.2 21.4,13.6
  Top 0.254: 21.4,13.6 v21.8,14
  Top 0.305: C2.2 v23.1,5.8
  Top 0.406: C3.2 v18.1,17.4 | C9.2 v15.5,15.8 | P1.9 32.82,7.6 v31.6,7.6 | P0.9 40.44,7.6 v39.38,7.6 38.3,7.6 P1.10 | J3.5 v17.1,8.9 J3.3 | C12.2 v16.2,11.2 | C11.2 v17.4,11.2 | C10.2 v19.6,11.2 | P0.10 45.92,7.6 v47.1,7.6 | 16.9,12.9 v17.3,13.3 | C13.2 v15.5,14.6 | U4.2 v7.7,10.7 | J1.5 v4.7,9.6 4.7,8.45 J1.S6 | 2,12.66 J1.S3 1.91,12.5 v1.91,11.43 1.91,10.29 2,10.2 J1.S4 | J1.S1 4.5,14.61 v4.5,13.5 | C15.2 v6,14.9 | U3.3 10.22,8.5 v9.5,8.5 | SW3.1 7.6,8.03 v7.6,7.3 | SW1.2 48.16,9.32 v47.73,8.89 | SW2.1 48.16,13.54 v47.73,13.97 | R14.2 v10,11.3 | v29.9,5.1 C8.2
  Top 0.61: J1.S6 4.38,8.13 J1.S5 J1.S4 | 1.98,14.73 J1.S2 | J1.S2 4.07,14.73 | J1.S2 J1.S3
  Bottom 0.406: v47.1,7.6 47.12,7.62 P4.5
  pour Route2 (isolate 0.125): 0,0 0,22.86 50.8,22.86 50.8,0
GPIO
  Top 0.127: U1.B1 19.2,15.2 19.5,15.2 19.9,15.6 R13.1
LOUT  (via drill 0.1, 0.25)
  Top 0.127: U1.B5 v18.7,13.5 | C14.1 21,14.4
  Top 0.254: 21,14.4 v20.6,14
  Bottom 0.127: v20.6,14 20.1,13.5 v18.7,13.5
N$1  (via drill 0.25)
  Top 0.127: U1.A6 v19.3,12.5 | D2.2 3.03,17 v6,17
  Bottom 0.127: v19.3,12.5 19.3,12.2 17.7,10.6 16,10.6 10.6,16 6.5,16 6,16.5 v6,17
N$2  (via drill 0.25)
  Top 0.127: U1.A5 19.6,13 19.6,12.8 v19.9,12.5 | D2.4 2.53,16.5 v6.5,16.5
  Bottom 0.127: v6.5,16.5 10.4,16.5 16.1,10.8 17.5,10.8 18.9,12.2 18.9,12.7 19.1,12.9 19.5,12.9 v19.9,12.5
N$3  (via drill 0.25)
  Top 0.127: U1.A4 v20.5,12.5 | D2.3 3.05,16 v6,16
  Bottom 0.127: v6,16 6.5,15.5 10.8,15.5 15.9,10.4 17.8,10.4 19,11.6 19.7,11.6 20.1,12 20.1,12.1 v20.5,12.5
N$4
  Bottom 0.127: JP4.1 J4.8
N$5
  Bottom 0.127: JP5.1 J4.7
N$6
  Top 0.127: U1.D1 C3.1
N$7
  Bottom 0.406: JP3.1 J4.14
N$8
  Top 0.075: 17.9,14.7 17.9,15.1
  Top 0.127: U1.D2 17.9,14.7 | 17.9,15.1 17.9,15.6 17.2,16.3 R5.1 16.8,17 16.8,17.7 16.9,17.8 18.6,17.8 R1.2
N$9
  Top 0.076: U1.D3 18.3,14.3 18.3,15.1
  Top 0.127: 18.3,15.1 18.3,15.6 19,16.3 R1.1
N$10
  Bottom 0.127: JP2.1 J5.2
N$11
  Bottom 0.406: JP1.2 J5.1
N$13
  Top 0.127: J3.9 13.97,9.83 13.8,10 11.9,10 R8.1 11.18,9.28 U3.2
N$14
  Top 0.127: R14.1 10.3,12.3 10.7,12.3 C17.2 12.2,12.6 | C18.2 12.4,12.6 12.2,12.6 | U5.C3 12.2,12.6
  Top 0.406: R14.1 9.5,13.1 J2.1
N$15
  Top 0.127: U5.B3 C17.1
N$17  (via drill 0.1, 0.25)
  Top 0.127: U1.C5 v18.7,13.1 | C16.2 15.6,12 v16.1,12
  Bottom 0.127: v16.1,12 16.5,11.6 17.8,11.6 18.5,12.3 18.5,12.9 v18.7,13.1
N$18  (via drill 0.1, 0.25)
  Top 0.127: U1.D5 v17.9,13.1 | C16.1 14.4,12.7 L1.1
  Top 0.406: L1.1 v16,12.7
  Bottom 0.406: v17.9,13.1 17.5,12.7
  Bottom 0.61: 17.5,12.7 v16,12.7
N$19  (via drill 0.1, 0.25)
  Top 0.127: U1.D4 v17.9,13.9
  Top 0.406: L1.2 v16,13.9
  Bottom 0.127: v17.9,13.9 17.7,13.9
  Bottom 0.61: 17.7,13.9 v16,13.9
N$46
  Top 0.127: R2.1 29.8,11.5 39.2,11.5 39.8,10.9 48.37,10.9 D1.2
N$47
  Top 0.127: 49.32,11.88 D1.4 48.88,12.3 48.1,12.3 47.3,11.5 40,11.5 39.6,11.9 31.4,11.9 R3.1
N$48
  Top 0.127: D1.3 48.45,11.86 47.79,11.2 39.9,11.2 39.4,11.7 30.6,11.7 R4.1
N$50
  Top 0.127: R6.1 25.25,18.7 Q2.3
N$55
  Top 0.127: U2.A3 26.1,8.1 C1.1
P0_0  (via drill 0.25)
  Top 0.076: U2.C2 26.31,9.2 26.51,9 26.8,9
  Top 0.127: 26.8,9 27,9 29.2,6.8 34.8,6.8 v35.5,7.5 | v40.3,11.9 40.3,12.54 P0.5
  Bottom 0.127: v35.5,7.5 39.9,11.9 v40.3,11.9
P0_1  (via drill 0.25)
  Top 0.127: U2.C1 27.1,9.2 27.5,8.8 28,8.8 29.6,7.2 v31,7.2 | 40.3,15.08 P0.3 | 39.8,14.9 39.9,15 40.22,15 P0.3 | P0.3 40.3,15.4 39.8,15.4 v39.8,16.1
  Bottom 0.127: v39.8,16.1 39.8,14.4 32.6,7.2 v31,7.2
P0_2  (via drill 0.1 pad 0.13, 0.25)
  Top 0.127: U2.D4 v25.6,9.4 | 40.18,17.78 P0.1 40.28,17.6 40,17.6 39.1,16.7 v31.8,16.7
  Bottom 0.127: v25.6,9.4 25.9,9.1 26.6,9.1 26.7,9 30.3,9 31.8,10.5 v31.8,16.7
P0_3  (via drill 0.1 pad 0.13, 0.25)
  Top 0.127: U2.D3 v26,9.4 | P0.7 40.22,10.4 39.9,10.4 39.7,10.2 39.7,9.7 39.4,9.4 31.9,9.4 31.8,9.5 v30.1,9.5
  Bottom 0.127: v30.1,9.5 29.9,9.3 26.9,9.3 26.8,9.4 v26,9.4
P0_4
  Top 0.127: U2.D1 27.3,9.6 27.7,9.2 28.9,9.2 29.3,8.8 40.5,8.8 41.1,9.4 44.9,9.4 45.4,9.9 45.64,9.9 P0.8
P0_5  (via drill 0.25)
  Top 0.076: U2.D2 26.4,9.4 26.8,9.4
  Top 0.127: 26.8,9.4 27.2,9.4 27.6,9 28.5,9 29,8.5 v41.5,8.5 | v44.3,14 45.3,15 45.66,15 P0.4
  Bottom 0.127: v41.5,8.5 42.8,9.8 42.8,12.5 v44.3,14
P0_6  (via drill 0.1 pad 0.13, 0.25)
  Top 0.127: U2.E3 v26,9.8 | P0.6 45.5,13.1 45.2,13.1 44.8,13.5 43.3,13.5 42.8,14 37.8,14 37.6,14.2 v31.3,14.2
  Bottom 0.127: v26,9.8 27.2,9.8 27.5,9.5 29.6,9.5 30.9,10.8 30.9,13.8 v31.3,14.2
P0_7  (via drill 0.25)
  Top 0.076: U2.E2 26.4,9.8 26.8,9.8
  Top 0.127: 26.8,9.8 27.4,9.8 27.8,9.4 29.4,9.4 29.7,9.1 39.9,9.1 v40.1,9.3 | 45.72,17.6 P0.2 45.58,17.78 45.1,17.3 45.1,17.2 v43.3,15.4
  Bottom 0.127: v40.1,9.3 41.1,10.3 41.1,13.2 v43.3,15.4
P1_0
  Top 0.127: U2.E1 27.5,10 27.9,9.6 29.4,9.6 29.96,10.16 P1.7
P1_1  (via drill 0.1 pad 0.13, 0.25)
  Top 0.127: U2.E4 v25.6,9.8 | P1.3 32.44,15.24 32.38,15.3 v31.3,15.3
  Bottom 0.127: v25.6,9.8 25.95,10.15 27.65,10.15 28,9.8 29.5,9.8 30.5,10.8 30.5,14.5 v31.3,15.3
P1_2  (via drill 0.25)
  Top 0.076: U2.F3 26,10.6 26.8,10.6
  Top 0.127: 26.8,10.6 v31.3,10.6 | v31.3,13 32.7,13 32.84,12.86 P1.5
  Bottom 0.127: v31.3,10.6 v31.3,13
P1_3  (via drill 0.25)
  Top 0.076: U2.F2 26.4,10.2 26.8,10.2
  Top 0.127: 26.8,10.2 27.6,10.2 28,9.8 29,9.8 v29.4,10.2 | P1.1 32.82,17.8 31.8,17.8 v31.3,17.3
  Bottom 0.127: v29.4,10.2 30.1,10.9 30.1,15.1 31.3,16.3 v31.3,17.3
P1_4  (via drill 0.1 pad 0.13, 0.25)
  Top 0.127: U2.F4 v25.6,10.2 | P1.2 37.98,17.78 37.3,17.1 31.7,17.1 31.3,16.7 v30.7,16.7
  Bottom 0.127: v25.6,10.2 25.8,10.4 27.8,10.4 28,10.6 28.4,10.6 29.8,12 29.8,15.8 v30.7,16.7
P1_5  (via drill 0.1 pad 0.13, 0.25)
  Top 0.127: U2.E5 v25.2,10.2 | P1.4 37.96,15.24 37.2,16 31.4,16 30.9,15.5 v29.4,15.5
  Bottom 0.127: v25.2,10.2 25.7,10.7 27.3,10.7 28,11.4 28.2,11.4 29.4,12.6 v29.4,15.5
P1_6
  Top 0.076: U2.G2 26.4,11 26.8,11
  Top 0.127: 38.14,10.3 P1.8 37.94,10.5 37.6,10.5 37.1,11 29.9,11 29.5,11.4 28,11.4 27.6,11 26.8,11
P1_7
  Top 0.076: U2.G3 26,11 26,11.8
  Top 0.127: 26,11.8 26,12 26.4,12.4 26.4,13.9 26.7,14.2 26.9,14.2 27.7,13.4 28.9,13.4 29,13.5 29,14.3 29.1,14.4 29.6,14.4 30.5,13.5 37.2,13.5 38,12.7 P1.6 38.08,12.5 37.7,12.5
P22_PHLD  (via drill 0.25)
  Top 0.076: U2.H3 25.6,11.4 25.6,11.8
  Top 0.127: 25.6,11.8 25.6,12.2 26,12.6 26,13.7 v25.7,14 | U1.A1 v19.8,14.9
  Bottom 0.127: v19.8,14.9 22.4,14.9 22.5,15 25,15 25.7,14.3 v25.7,14
P23_IRQ  (via drill 0.25)
  Top 0.075: 18.7,14.3 19.5,14.3
  Top 0.127: U2.J3 25.8,12.1 26.2,12.5 v26.2,14.2 | U1.C2 18.7,14.3 | 19.5,14.3 20.4,14.3 v21.5,15.4
  Bottom 0.127: v26.2,14.2 25,15.4 v21.5,15.4
P24_LED1  (via drill 0.1 pad 0.13, 0.25)
  Top 0.127: U2.G4 v25.6,11 | v28.1,11.8 28.5,11.8 R2.2
  Bottom 0.127: v25.6,11 27.3,11 v28.1,11.8
P25_LED2
  Top 0.076: U2.H4 25.2,11.4 25.2,11.8
  Top 0.127: 25.2,11.8 25.2,14 25.8,14.6 27.2,14.6 27.9,13.9 R3.2
P26_LED3  (via drill 0.1 pad 0.13, 0.25)
  Top 0.127: U2.G5 v25.2,11 | v28.1,12.5 28.3,12.7 28.4,12.7 R4.2
  Bottom 0.127: v25.2,11 25.5,11.3 27.3,11.3 27.6,11.6 27.6,12 v28.1,12.5
P27_BUTTON
  Top 0.075: U2.H5 24.8,11.4 24.8,11.8
  Top 0.127: 24.8,11.8 24.8,12.2 24.4,12.6 24.4,14.9 25.9,16.4 28.6,16.4 30,17.8 30.6,17.8 31.6,18.8 46.6,18.8 47.2,18.2 47.2,16.9 50.3,13.8 50.3,6.9 49.6,6.2 49.17,6.2 SW1.1
P30_RX  (via drill 0.1 pad 0.13)
  Top 0.127: U2.F5 v24.8,10.2
  Bottom 0.127: v24.8,10.2 24,9.4 24,8.4 25.8,6.6 30,6.6 30.1,6.5 34.14,6.5 J4.3
P31_TX  (via drill 0.1 pad 0.13)
  Top 0.127: U2.E6 v24.8,9.8
  Bottom 0.127: v24.8,9.8 24.3,9.3 24.3,8.6 25.9,7 30.5,7 30.7,6.8 36.38,6.8 J4.2
P32_CTS  (via drill 0.25)
  Top 0.075: U2.H6 24.4,11.4 24.4,12
  Top 0.127: 24.4,12 24,12.4 24,15.7 28.7,20.4 v35.1,20.4
  Bottom 0.127: v35.1,20.4 38.18,20.4 J5.10
P33_RTS
  Top 0.127: U2.J6 24.6,12.1 24.2,12.5 24.2,15.2 29,20 35.24,20 J5.9
P34_SDA  (via drill 0.1 pad 0.13, 0.25)
  Top 0.127: U2.G6 v24.8,11 | J5.12 42.46,19.6 37,19.6 36.8,19.4 31,19.4 v29,17.4
  Bottom 0.127: v24.8,11 25.3,11.5 26.4,11.5 27,12.1 27.2,12.1 29,13.9 v29,17.4
P35_SCL  (via drill 0.1 pad 0.13, 0.25)
  Top 0.127: U2.F6 v24.4,10.6 | J5.11 40.62,20.3 36.4,20.3 35.8,19.7 30.7,19.7 28.5,17.5 v28.5,17
  Bottom 0.127: v24.4,10.6 24.4,11.1 25.1,11.8 26.2,11.8 26.8,12.4 27.2,12.4 28.5,13.7 v28.5,17
P36_ALRT  (via drill 0.25)
  Top 0.075: 12.8,11.6 13.2,11.6
  Top 0.127: U2.J7 24.2,11.9 23.8,12.3 23.8,13.9 v23.1,14.6 | U5.B2 12.8,11.6 | 13.2,11.6 v13.8,11.6
  Bottom 0.127: v13.8,11.6 14.3,11.6 15.8,10.1 18,10.1 18.7,10.8 19.7,10.8 20,11.1 20,11.5 v23.1,14.6
P40_OWM
  Top 0.127: R6.2 24.13,19.23 J5.4 | U2.J8 23.4,12 23.4,12.4 22.5,13.3 22.5,17.6 R6.2 | 23.4,18.5 R6.2
P41_PUE
  Top 0.075: U2.H7 24,11.4 24,11.8
  Top 0.127: Q2.1 24.45,18.05 R7.1 22.7,16.3 22.7,14.3 23.6,13.4 23.6,12.2 24,11.8
P44_SCK  (via drill 0.1 pad 0.13, 0.25)
  Top 0.127: U2.G7 v24,11 | v43.4,12.4 42.3,13.5 37.7,13.5 37.4,13.8 30.9,13.8 30.1,14.6 v28.1,14.6
  Bottom 0.127: P4.4 48.04,10.16 46.75,11.45 46.7,11.4 44.4,11.4 v43.4,12.4 | v24,11 25.1,12.1 26,12.1 26.6,12.7 27.2,12.7 28.1,13.6 v28.1,14.6
P45_MOSI  (via drill 0.25)
  Top 0.127: U2.G9 23.1,10.8 22.6,11.3 v22.6,12.7 | v43.2,16.6 39.6,16.6 39.3,16.3 31,16.3 30.7,16 29.3,16 28.7,15.4 25.6,15.4 v24.8,14.6
  Bottom 0.127: P4.2 47.96,15.24 46.6,16.6 v43.2,16.6 | v22.6,12.7 24.5,14.6 v24.8,14.6
P46_MISO  (via drill 0.25)
  Top 0.075: U2.G8 23.6,11 23.2,11
  Top 0.127: 23.2,11 23,11.2 v23,12.3 | v43.2,14.5 31.5,14.5 31,15 25.8,15 v24.8,14
  Bottom 0.127: P4.3 48,12.7 46.2,14.5 v43.2,14.5 | v23,12.3 24.4,13.7 24.5,13.7 v24.8,14
P47_SSN  (via drill 0.1, 0.25)
  Top 0.075: U2.F9 23.51,10.4 23.71,10.2 23.9,10.2 24,10.3 v24,10.6
  Top 0.127: v28.1,15.8 28.6,15.8 30.1,17.3 30.8,17.3 32,18.5 42.9,18.5 v43.2,18.2
  Bottom 0.127: P4.1 47.92,17.78 47.85,17.85 | 47.85,17.65 47.85,17.85 | v43.2,18.2 43.5,18.5 47.2,18.5 47.85,17.85 | v24,10.6 23.7,10.9 23.7,11.1 24.9,12.3 25.7,12.3 26.3,12.9 27.1,12.9 27.4,13.2 27.4,15.1 v28.1,15.8
P50_SCK  (via drill 0.1 pad 0.13)
  Top 0.076: U2.D7 24.4,9.8 v24.4,10.2
  Bottom 0.127: v24.4,10.2 23.1,10.2 22.6,9.7 22.6,9 23.4,8.2 23.4,7 25.4,5 29.3,5 31.75,2.55 J4.6
P51_MOSI  (via drill 0.1 pad 0.13)
  Top 0.127: U2.E7 v24,9.8
  Bottom 0.127: J4.5 30.06,5.5 29.5,5.5 29.4,5.4 25.9,5.4 23.8,7.5 23.8,8.4 23.3,8.9 23.3,9.1 v24,9.8
P52_MISO  (via drill 0.25 pad 0.13)
  Top 0.076: U2.C7 24.4,9 24.4,8.2
  Top 0.127: 24.4,8.2 24.2,8 v24.2,7.6
  Bottom 0.127: J4.4 33,5.1 33,5.9 32.7,6.2 25.6,6.2 v24.2,7.6
P53_SSN  (via drill 0.1 pad 0.13)
  Top 0.127: U2.D6 v24.8,9.4
  Bottom 0.127: v24.8,9.4 24.5,9.1 24.5,8.9 26,7.4 30.5,7.4 30.7,7.6 31.1,7.6 33.4,9.9 33.4,20.7 J5.8
P54_SDIO2  (via drill 0.1 pad 0.13)
  Top 0.127: U2.C6 v24.8,9
  Bottom 0.127: v24.8,9 26.2,7.6 26.8,7.6 27.2,8 30.9,8 33,10.1 33,20.34 J5.7
P55_SDIO3  (via drill 0.1 pad 0.13)
  Top 0.127: U2.C5 v25.2,9
  Bottom 0.127: v25.2,9 25.9,8.3 26.3,8.3 26.4,8.4 30.7,8.4 32.6,10.3 32.6,18.2 J5.6
P56_SRN  (via drill 0.1 pad 0.13)
  Top 0.127: U2.D5 v25.2,9.4
  Bottom 0.127: v25.2,9.4 25.7,8.9 26.1,8.9 26.3,8.7 30.5,8.7 32.2,10.4 32.2,17.1 29.3,20 28.26,20 J5.5
P57_SDA  (via drill 0.25)
  Top 0.075: U2.C4 25.6,9 25.6,8.2
  Top 0.127: 25.6,8.2 25.6,4.6 v26.1,4.1 26.5,4.5 R10.1 | U5.C1 v13,12.6 | v21.1,11.4 21.5,11.8 21.5,12.4 19.8,14.1 U1.A3
  Bottom 0.127: 19.9,9.4 20,9.4 20.3,9.1 20.3,6.8 23,4.1 v26.1,4.1 JP4.2 | 19.9,9.4 14.3,9.4 13,10.7 v13,12.6 | v21.1,11.4 19.9,10.2 19.9,9.4
P60_SCL  (via drill 0.25)
  Top 0.075: U2.C3 26,9 26.29,9 26.4,8.89 26.4,8.7 26.5,8.6 26.8,8.6 | 19.1,13.9 19.5,13.9
  Top 0.127: 26.8,8.6 27.1,8.3 R9.1 27.5,6.7 v27.5,4.6 | U1.B4 19.1,13.9 | U5.A2 13,11 v13.4,11 | 19.5,13.9 19.7,13.9 21.1,12.5 v21.1,12
  Bottom 0.127: JP5.2 28.14,4.6 v27.5,4.6 24.9,4.6 23.3,6.2 22.8,6.2 22.6,6 21.9,6 21,6.9 21,10.2 22.1,11.3 22.1,11.5 21.6,12 v21.1,12 20.3,11.2 20.3,11 19.1,9.8 15.6,9.8 14.4,11 v13.4,11
PVIO  (via drill 0.25)
  Top 0.127: 32.76,5.1 32.78,5.08 P1.11 32.98,5.08 33,5.1
  Top 0.406: P1.11 32.86,5.1 | 33,5.1 34,4.1 37.1,4.1 38.08,5.08 P1.12 38.3,5.1 40.3,5.1 40.32,5.08 P0.11 40.62,5.08 41.6,4.1 44.7,4.1 45.7,5.1 45.88,5.1 P0.12 | 32.76,5.1 v31.7,5.1 C8.1
  Bottom 0.406: JP6.2 v31.7,5.1
SWCLK  (via drill 0.25)
  Top 0.075: U2.B4 25.2,8.6 25.2,8.2
  Top 0.127: 25.2,8.2 25.2,5.1 23.1,3 18.18,3 v17.78,3.4 TP3.P$1 17.8,5.06
  Bottom 0.127: TP3.P$1 v17.78,3.4
SWDIO  (via drill 0.25)
  Top 0.075: U2.B5 24.8,8.6 24.8,8.2
  Top 0.127: 19.07,5.1 J3.2 19.1,5.03 19.1,4.1 19.4,3.8 v20.32,3.8 22.8,3.8 24.8,5.8 24.8,8.2
  Bottom 0.127: TP4.P$1 v20.32,3.8
SYS  (via drill 0.25)
  Top 0.127: U1.E2 v17.3,14.5 | 16.5,13.7 C5.1 U1.E4 | v19,18 19.7,18 R12.2
  Top 0.406: 16.5,13.7 v16.1,13.3
  Route15 0.406: v16.1,13.3 v17.3,14.5
  Bottom 0.127: v19,18 17.2,18 17,18.2
  Bottom 0.406: v17.3,14.5 17,14.8 | JP1.1 17.21,18.91 17,18.7
  Bottom 1.016: 17,14.8 17,18.2 17,18.7
VBAT  (via drill 0.25)
  Top 0.127: U1.E3 17.1,14.1 | 16.8,14.4 C13.1 | U5.B1 13.6,12.4 13.6,13.6 C18.1 11.8,14.1 11.6,14.3 11.6,15 11.8,15.2 | 11.8,15.6 J2.2
  Top 0.254: 17.1,14.1 16.8,14.4
  Top 0.406: 11.8,15.2 11.8,15.6 | v14.7,15.2 16.3,15.2 16.8,14.7 C13.1
  Top 0.813: 11.8,15.2 v14.7,15.2
  Bottom 0.406: JP1.3 14.7,18.57
  Bottom 0.813: 14.7,18.57 v14.7,15.2
VBUS
  Top 0.127: U1.E1 17.4,15.2
  Top 0.406: 17.4,15.2 C9.1 16.6,16 16.6,16.3 16.1,16.8 | U4.5 7.7,13.6 | J1.1 5.13,12.73 5.4,13
  Top 0.813: 16.1,18.8 8.6,18.8 7.7,17.9 7.7,13.6 C15.1 5.4,13 | 16.1,18.8 18.8,18.8 J5.3 | 16.1,16.8 16.1,18.8
XI
  Top 0.127: U2.B9 22,7.4 21.65,7.4 Y1.2
XO
  Top 0.127: U2.C9 21.75,9.2 Y1.1

### Text on the board
tPlace: SYS | EN | USB | OWM | SRN | SD3 | SD2 | SS | RTS | CTS | SCL | SDA | MAX77650 | POWER | CHG | P1 | P0 | BAT- | BAT+ | MAX32620 | MAX32620FTHR | RGB | MAXDAP | RESET | BOOT | AIN | RST | 3V | 1V8 | GND | 0 | 1 | 2 | 3 | I2CM2 | SCK | MO | MI | RX | TX | GND
bPlace: MAX17055 / ModelGauge EZ | 5V | 4_0 | 5_6 | 5_5 | 5_4 | 5_3 | 3_2 | 3_2 | 3_5 | 3_4 | SPIS | BAT | SYS | EN | SS | SD2 | CTS | SS | MAX77650 PMIC / Ultra-Low Power / SIMO Buck-Boost / Li-Poly Charger | MAX32620FTHR | 3 | 4 | XIP | 2 | 7 | SSEL | MO | 1 | 5 | SD3 | TX | 1 | 5 | MO | SPIM1 | UART0 | SPIM0 | SIMO | D- | MI | SCL | RX | MI | 2 | 7 | 0 | 6 | SOMI | I2CM0 | D+ | MAX32620 96MHz / ARM Cortex M4F / 2MB Flash / 256KB SRAM / Dual Voltage I/O | SCK | 0 | 6 | SDA | RTS | 3 | 4 | SCK | SCK | GND | GND | GND | GND | GND | PVIO | 1V8 | PORT 1 | PORT 0 | AI0 | swclk | swdio | 3V | VIO | VIO | VIO | 1V8 | 5_7 | 6_0 | RST | 3V | GND | AI0 | AI1 | AI2 | AI3 | 5_0 | 5_1 | 5_2 | 3_0 | 3_1 | GND
DrillLegend: LAYER-STACK
FabDoc1: 1 - TOP / 2 - GND / 15 - PWR / 16 - BOT | MAX32620FTHR Revision 2 | Dielectric - Standard FR-4 / Finish - ENIG / Soldermask - Black / Silkscreen - White | Notes: / All vias must be covered with soldermask. / 0.1mm drill vias can be plated shut. Any drill that fits in the pad is acceptable. / There are 2 plated slots at J1